# Altium schematic sheet DAP-Peripherals.SchDoc
size A; SheetNumber: 4; SheetTotal: 4
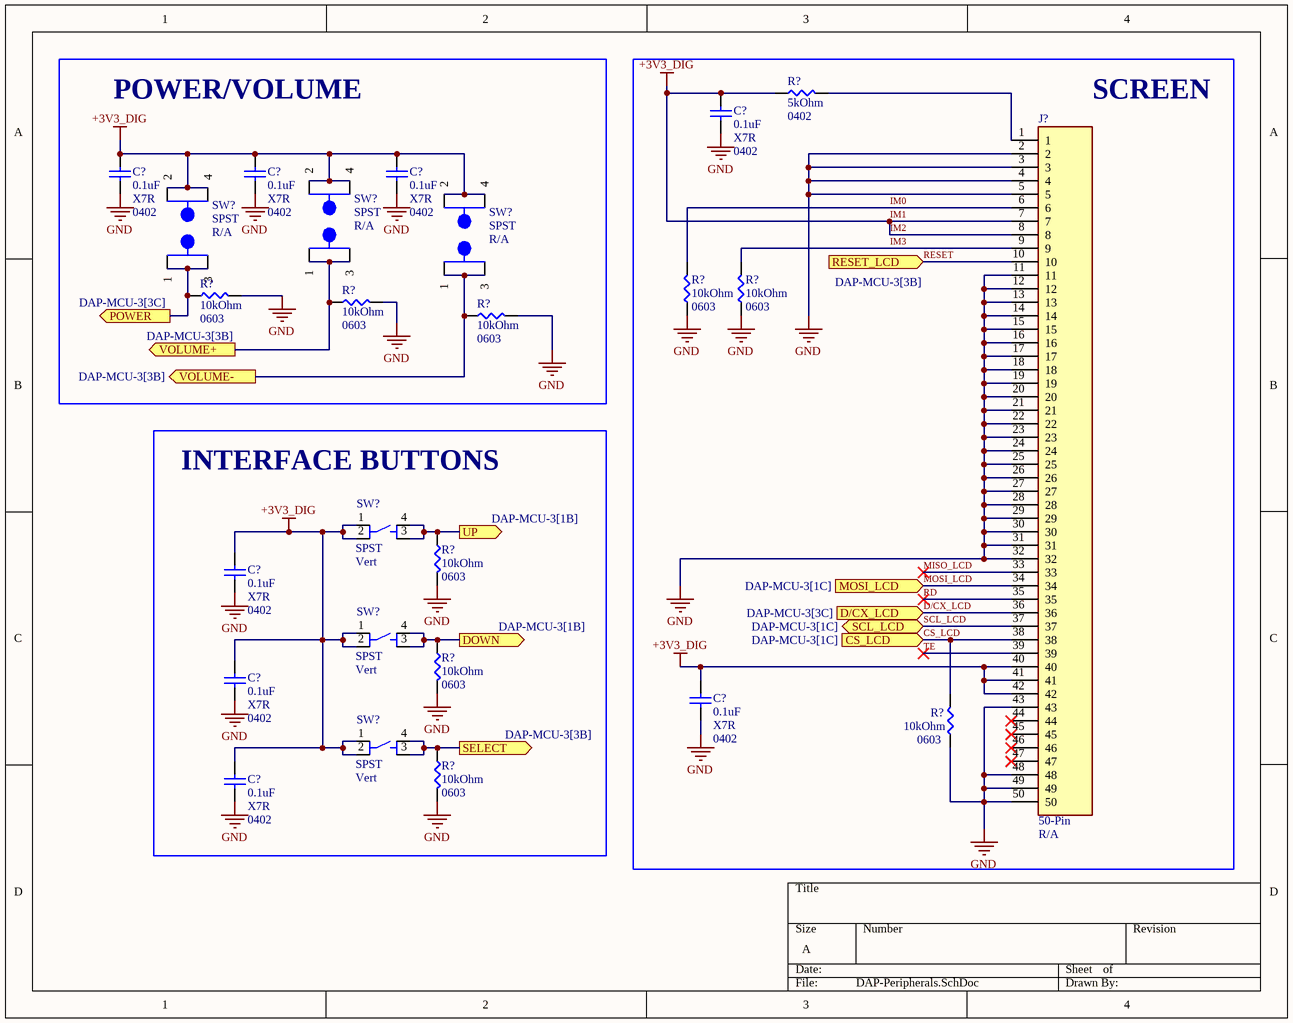
[diagram p0: DAP-Peripherals.SchDoc]

## Parts
(Parts that share a designator on the sheet are numbered #1, #2 ... from top to bottom, then left to right.)
C?#1  <Value>: 0.1uF  <Spec>: X7R  <Footprint>: 0402  [CAPC1005X60N]  (hidden comment: CAP CER 0.1UF 50V X7R 0402)
C?#2  <Value>: 0.1uF  <Spec>: X7R  <Footprint>: 0402  [CAPC1005X60N]  (hidden comment: CAP CER 0.1UF 50V X7R 0402)
C?#3  <Value>: 0.1uF  <Spec>: X7R  <Footprint>: 0402  [CAPC1005X60N]  (hidden comment: CAP CER 0.1UF 50V X7R 0402)
C?#4  <Value>: 0.1uF  <Spec>: X7R  <Footprint>: 0402  [CAPC1005X60N]  (hidden comment: CAP CER 0.1UF 50V X7R 0402)
C?#5  <Value>: 0.1uF  <Spec>: X7R  <Footprint>: 0402  [CAPC1005X60N]  (hidden comment: CAP CER 0.1UF 50V X7R 0402)
C?#6  <Value>: 0.1uF  <Spec>: X7R  <Footprint>: 0402  [CAPC1005X60N]  (hidden comment: CAP CER 0.1UF 50V X7R 0402)
C?#7  <Value>: 0.1uF  <Spec>: X7R  <Footprint>: 0402  [CAPC1005X60N]  (hidden comment: CAP CER 0.1UF 50V X7R 0402)
C?#8  <Value>: 0.1uF  <Spec>: X7R  <Footprint>: 0402  [CAPC1005X60N]  (hidden comment: CAP CER 0.1UF 50V X7R 0402)
J?  <Value>: 50-Pin  <Footprint>: R/A  [AMPHENOL_F32D-1A7Y1-21050]  (hidden comment: CONN FFC BOTTOM 50POS 0.5MM R/A)
R?#1  <Value>: 5kOhm  <Footprint>: 0402  [RESC1005X40N]  (hidden comment: RES 5K OHM 1% 1/16W 0402)
R?#2  <Value>: 10kOhm  <Footprint>: 0603  [RESC1608X55N]  (hidden comment: RES SMD 10K OHM 0.5% 1/10W 0603)
R?#3  <Value>: 10kOhm  <Footprint>: 0603  [RESC1608X55N]  (hidden comment: RES SMD 10K OHM 0.5% 1/10W 0603)
R?#4  <Value>: 10kOhm  <Footprint>: 0603  [RESC1608X55N]  (hidden comment: RES SMD 10K OHM 0.5% 1/10W 0603)
R?#5  <Value>: 10kOhm  <Footprint>: 0603  [RESC1608X55N]  (hidden comment: RES SMD 10K OHM 0.5% 1/10W 0603)
R?#6  <Value>: 10kOhm  <Footprint>: 0603  [RESC1608X55N]  (hidden comment: RES SMD 10K OHM 0.5% 1/10W 0603)
R?#7  <Value>: 10kOhm  <Footprint>: 0603  [RESC1608X55N]  (hidden comment: RES SMD 10K OHM 0.5% 1/10W 0603)
R?#8  <Value>: 10kOhm  <Footprint>: 0603  [RESC1608X55N]  (hidden comment: RES SMD 10K OHM 0.5% 1/10W 0603)
R?#9  <Value>: 10kOhm  <Footprint>: 0603  [RESC1608X55N]  (hidden comment: RES SMD 10K OHM 0.5% 1/10W 0603)
R?#10  <Value>: 10kOhm  <Footprint>: 0603  [RESC1608X55N]  (hidden comment: RES SMD 10K OHM 0.5% 1/10W 0603)
SW?#1  <Value>: SPST  <Footprint>: R/A  [SW_TL1014BF220QG]  (hidden comment: SWITCH TACTILE SPST-NO 0.05A 12V)
SW?#2  <Value>: SPST  <Footprint>: R/A  [SW_TL1014BF220QG]  (hidden comment: SWITCH TACTILE SPST-NO 0.05A 12V)
SW?#3  <Value>: SPST  <Footprint>: R/A  [SW_TL1014BF220QG]  (hidden comment: SWITCH TACTILE SPST-NO 0.05A 12V)
SW?#4  <Value>: SPST  <Footprint>: Vert  [SW_PTS810_SJM_250_SMTR_LFS]  (hidden comment: SWITCH TACTILE SPST-NO 0.05A 16V)
SW?#5  <Value>: SPST  <Footprint>: Vert  [SW_PTS810_SJM_250_SMTR_LFS]  (hidden comment: SWITCH TACTILE SPST-NO 0.05A 16V)
SW?#6  <Value>: SPST  <Footprint>: Vert  [SW_PTS810_SJM_250_SMTR_LFS]  (hidden comment: SWITCH TACTILE SPST-NO 0.05A 16V)

## Blocks framed on the sheet
POWER/VOLUME: C?#2-C?#4 R?#4-R?#6 SW?#1-SW?#3
SCREEN: C?#1 C?#7 J? R?#1-R?#3 R?#9
INTERFACE BUTTONS: C?#5 C?#6 C?#8 R?#7 R?#8 R?#10 SW?#4-SW?#6

## Ports
CS_LCD (in, see DAP-MCU-3[1C]), D/CX_LCD (in, see DAP-MCU-3[3C]), DOWN (out, see DAP-MCU-3[1B]), MOSI_LCD (in, see DAP-MCU-3[1C]), POWER (out, see DAP-MCU-3[3C]), RESET_LCD (in, see DAP-MCU-3[3B]), SCL_LCD (bidir, see DAP-MCU-3[1C]), SELECT (out, see DAP-MCU-3[3B]), UP (out, see DAP-MCU-3[1B]), VOLUME+ (out, see DAP-MCU-3[3B]), VOLUME- (out, see DAP-MCU-3[3B])

## Nets
GND: C?#1.1 C?#2.1 C?#3.1 C?#4.1 C?#5.1 C?#6.1 C?#7.1 C?#8.1 J?.2 J?.3 J?.4 J?.5 J?.11 J?.12 J?.13 J?.14 J?.15 J?.16 J?.17 J?.18 J?.19 J?.20 J?.21 J?.22 J?.23 J?.24 J?.25 J?.26 J?.27 J?.28 J?.29 J?.30 J?.31 J?.32 J?.43 J?.48 J?.49 J?.50 R?#2.2 R?#3.2 R?#4.1 R?#5.1 R?#6.1 R?#7.1 R?#8.1 R?#9.2 R?#10.1
IM1: C?#1.2 C?#2.2 C?#3.2 C?#4.2 C?#5.2 C?#6.2 C?#7.2 C?#8.2 J?.7 J?.8 J?.40 J?.41 J?.42 R?#1.2 SW?#4.1 SW?#4.2 SW?#5.1 SW?#5.2 SW?#6.1 SW?#6.2  [also labelled +3V3_DIG, IM2]
CS_LCD: J?.38 R?#9.1 ; port CS_LCD
D/CX_LCD: J?.36 ; port D/CX_LCD
DOWN: R?#8.2 SW?#5.3 SW?#5.4 ; port DOWN
IM0: J?.6 R?#2.1
IM3: J?.9 R?#3.1
MISO_LCD: J?.33
MOSI_LCD: J?.34 ; port MOSI_LCD
POWER: R?#4.2 ; port POWER
RD: J?.35
RESET: J?.10 ; port RESET_LCD
SCL_LCD: J?.37 ; port SCL_LCD
SELECT: R?#10.2 SW?#6.3 SW?#6.4 ; port SELECT
TE: J?.39
UP: R?#7.2 SW?#4.3 SW?#4.4 ; port UP
VOLUME+: R?#5.2 ; port VOLUME+
VOLUME-: R?#6.2 ; port VOLUME-
NetJ?_1: J?.1 R?#1.1

Not connected (* = marked no-connect by the designer): J? 44* 45* 46* 47*; SW?#1 1 2 3 4; SW?#2 1 2 3 4; SW?#3 1 2 3 4

## Library data of the parts
C?#1-C?#8 = #1-080: Manufacturer 1: Murata Electronics; Manufacturer Part Number 1: GCM155R71H104KE02D; AL-PN: #1-080; SubType: Ceramic; <Tolerance>: 0.1; <Termination>: SMD; Creator Project: DAP; Type: Standard; Lead Time: 21 Weeks; PartType: Capacitor; <Rating>: 50V; Status: Verified; Supplier 1: Digikey; Supplier Label: 0.1 µF ±10% 50V Ceramic Capacitor X7R 0402 (1005 Metric); Supplier Part Number 1: 490-10672-1-ND
J? = #1-117: Manufacturer 1: Amphenol ICC; MF: Amphenol ICC (FCI); AL-PN: #1-117; <Termination>: SMD; Creator Project: DAP; Lead Time: 13 Weeks; SnapEDA_Link: https://www.snapeda.com/parts/F32D-1A7Y1-21050/Amphenol+FCI/view-part/?ref=snap; Package: None; Value: *; MP: F32D-1A7Y1-21050; Check_prices: https://www.snapeda.com/parts/F32D-1A7Y1-21050/Amphenol+FCI/view-part/?ref=eda; PartType: Connector; SubType: FFC; Status: Verified; Supplier 1: Digikey; Supplier Label: 50 Position FFC, FPC Connector Contacts, Top and Bottom 0.020" (0.50mm) Surface Mount, Right Angle; Supplier Part Number 1: 609-F32D-1A7Y1-21050CT-ND; Type: Standard; Manufacturer Part Number 1: F32D-1A7Y1-21050
R?#1 = #1-060: Manufacturer 1: YAGEO; Manufacturer Part Number 1: RC0402FR-075KL; AL-PN: #1-060; <Tolerance>: 0.01; <Termination>: SMD; Creator Project: DAP; Lead Time: 17 Weeks; PartType: Resistor; <Rating>: 1/16W; Status: Verified; Supplier 1: Digikey; Supplier Label: 5 kOhms ±1% 0.063W, 1/16W Chip Resistor 0402 (1005 Metric) Moisture Resistant Thick Film; Supplier Part Number 1: 13-RC0402FR-075KLCT-ND; Type: Standard
R?#2-R?#10 = #1-007: Manufacturer 1: YAGEO; Manufacturer Part Number 1: RT0603DRD0710KL; AL-PN: #1-007; <Rating>: 0.1W; <Tolerance>: 0.005; Creator Project: Bootcamp; Lead Time: 20 Weeks; PartType: Resistor; <Termination>: SMD; Status: Verified; Supplier 1: Digikey; Supplier Label: 10 kOhms ±0.5% 0.1W, 1/10W Chip Resistor 0603 (1608 Metric) Thin Film; Supplier Part Number 1: 311-10KDTR-ND; Type: Standard
SW?#1-SW?#3 = #1-114: Manufacturer 1: E-Switch; Manufacturer Part Number 1: TL1014BF220QG; AL-PN: #1-114; SubType: Tacticle; <Termination>: SMD; Creator Project: DAP; Lead Time: 7 Weeks; PartType: Switch; Status: Verified; Supplier 1: Digikey; Supplier Label: Tactile Switch SPST-NO Side Actuated Surface Mount, Right Angle; Supplier Part Number 1: 141-TL1014BF220QGCT-ND; Type: Standard
SW?#4-SW?#6 = #1-115: Manufacturer Part Number 1: PTS810SJM250SMTR LFS; MF: C&K; MP: PTS810 SJM 250 SMTR LFS; AL-PN: #1-115; SubType: Tacticle; <Termination>: SMD; Creator Project: DAP; Lead Time: 16 Weeks; SnapEDA_Link: https://www.snapeda.com/parts/PTS810%20SJM%20250%20SMTR%20LFS/C%2526K/view-part/?ref=snap; Package: None; Value: *; Check_prices: https://www.snapeda.com/parts/PTS810%20SJM%20250%20SMTR%20LFS/C%2526K/view-part/?ref=eda; PartType: Switch; Status: Verified; Supplier 1: Digikey; Supplier Label: Tactile Switch SPST-NO Top Actuated Surface Mount; Supplier Part Number 1: CKN10502CT-ND; Type: Standard; Manufacturer 1: C&K